# EAGLE design scheme (EAGLE 6.4)
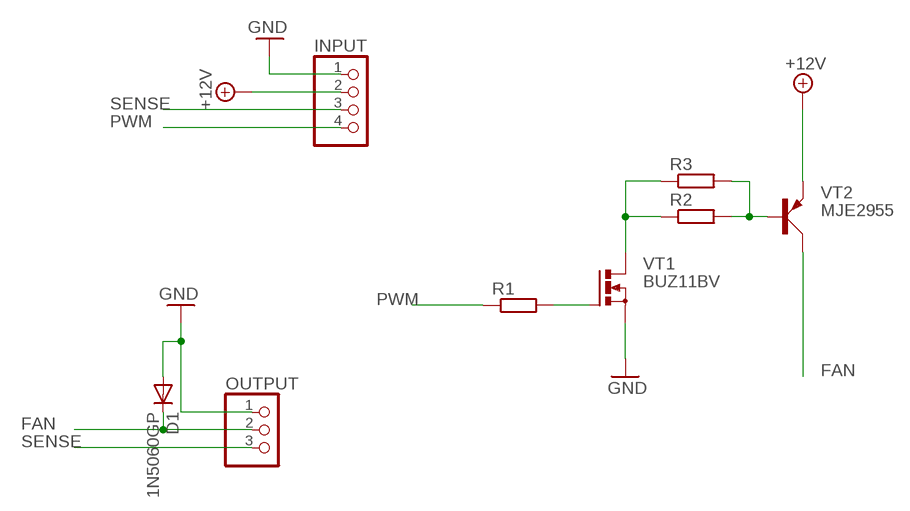
[diagram p0: schematic, sheet 1]

## Parts
D1  1N5060GP  [DO15-12]
INPUT  PINHD-1X4  [1X04]
OUTPUT  PINHD-1X3  [1X03]
R1  R-EU_0204/7  [0204/7]
R2  R-EU_0411/15  [0411/15]
R3  R-EU_0411/15  [0411/15]
VT1  BUZ11BV  [TO220BV]
VT2  MJE2955  [TO220AV]

## Nets
+12V: INPUT.2 VT2.E
FAN: D1.C OUTPUT.2 VT2.C
GND: D1.A INPUT.1 OUTPUT.1 VT1.S
N$2: R2.2 R3.2 VT2.B
N$3: R2.1 R3.1 VT1.D
N$4: R1.2 VT1.G
PWM: INPUT.4 R1.1
SENSE: INPUT.3 OUTPUT.3

## Library data of the parts
D1 = diode:1N5060GP: DIODE controlled avalanche rectifier
INPUT = pinhead:PINHD-1X4: PIN HEADER
OUTPUT = pinhead:PINHD-1X3: PIN HEADER
R1-R3 = resistor:R-EU_: RESISTOR, European symbol
VT1 = transistor-power:BUZ11: N-CHANNEL MOS FET
VT2 = transistor-power:MJE2955: PNP TRANSISTOR

## Board
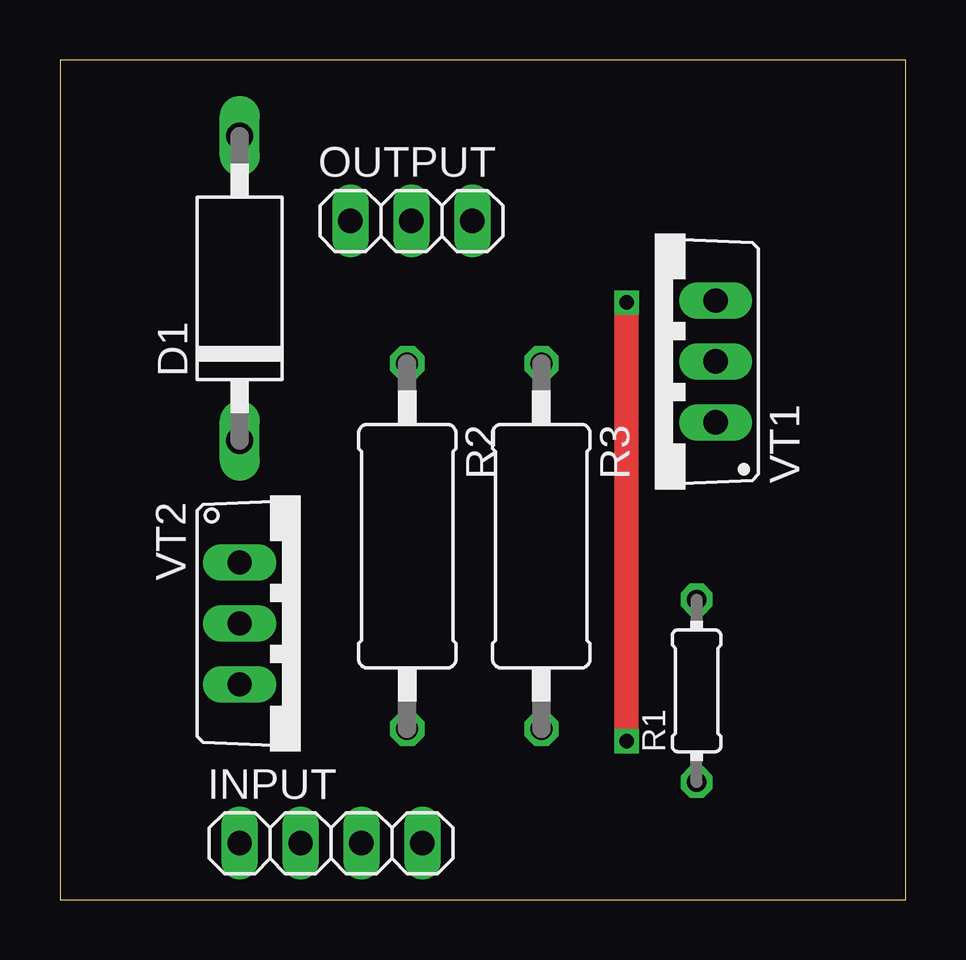
[diagram p1: board, top side]
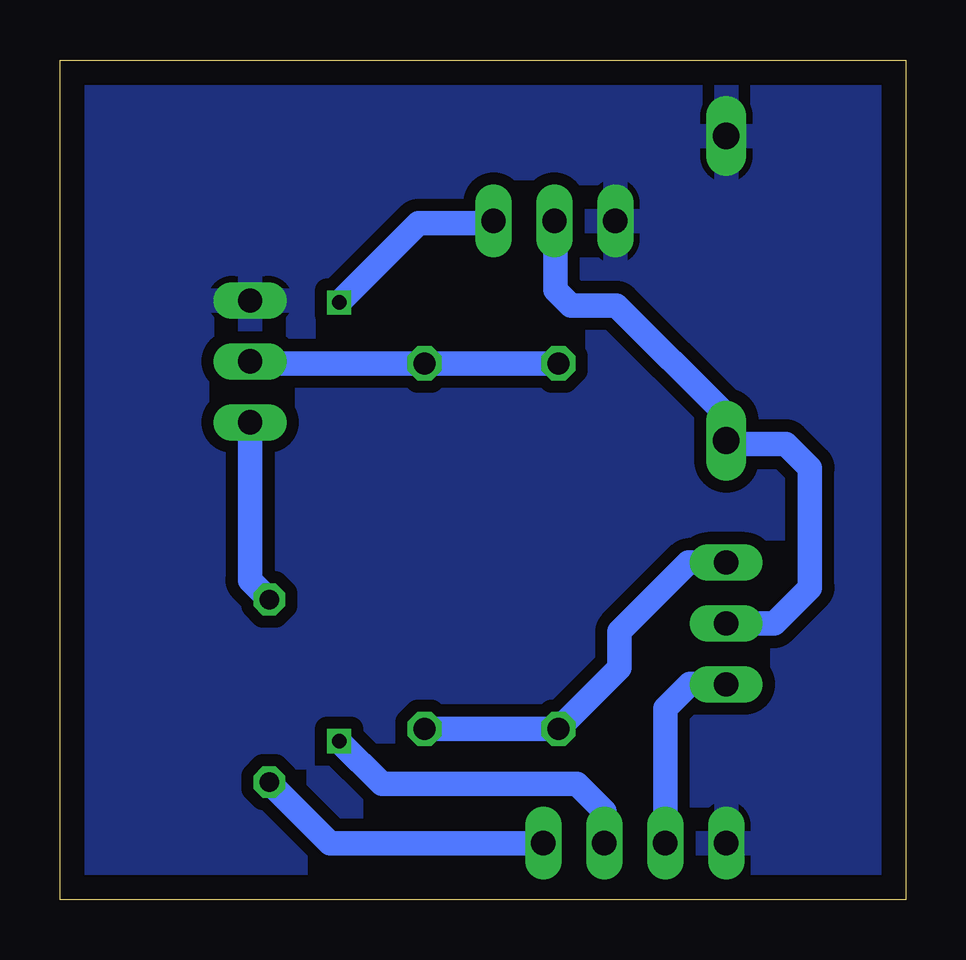
[diagram p2: board, bottom side, seen from below]

Size 35.26 x 35 mm. Coordinates in mm from the lower left corner, seen from the top.
Outline: 0,0 35.26,0 35.26,35 0,35 0,0
Copper layers (1*16): Top 0.035mm / dielectric 1.5mm / Bottom 0.035mm
Design rules "default": minimum track width 10mil, minimum drill 24mil, track to track 8mil, track to pad 8mil, pad to pad 8mil, via to via 8mil, smd to smd 8mil, copper to edge 40mil, drill to drill 8mil, minimum pad ring 10mil, minimum via ring 8mil, stop-mask expansion 4mil, vias tented up to drill 0mil, thermal gap 10mil

### Footprints (pad centres in the part's own frame; a part is rotated, then mirrored left to right if it is on the bottom)
DO15-12 = drill 1.118 long: A 6.35,0; C -6.35,0
1X04 = drill 1.016 long: 1 -3.81,0; 2 -1.27,0; 3 1.27,0; 4 3.81,0
1X03 = drill 1.016 long: 1 -2.54,0; 2 0,0; 3 2.54,0
0204/7 = drill 0.813 octagon: 1 -3.81,0; 2 3.81,0
0411/15 = drill 0.914 octagon: 1 -7.62,0; 2 7.62,0
TO220BV = drill 1.016 long: D 0,-2.54; G -2.54,-2.54; S 2.54,-2.54
TO220AV = drill 1.016 long: B -2.54,-2.54; C 0,-2.54; E 2.54,-2.54

### Placement (x,y rotation side)
D1  7.49,25.48 90 top
INPUT  11.3,2.35 0 top
OUTPUT  14.65,28.29 0 top
R1  26.54,8.7 90 top
R2  14.48,14.73 270 top
R3  20.07,14.73 270 top
VT1  24.8,22.43 90 top
VT2  10.03,11.51 270 top

### Tracks (layer width: path | path; a pad name or v marks a point on that pad's centre or on a via)
+12V
  Bottom 1.016: INPUT.2 10.03,7.97 9,9 7.52,9 VT2.E
FAN
  Bottom 1.016: VT2.C 5.49,11.51 4,13 4,18 5,19 7.36,19 D1.C 7.49,20.19 12.06,24.77 13.97,24.77 14.61,25.4 14.61,28.25 OUTPUT.2
GND
  pour Bottom (isolate 0.508): 1.27,0 1.27,36.75 40.64,36.75 40.64,0
N$2
  Bottom 1.016: VT2.B 9.06,14.05 11.94,11.18 11.94,9.65 R2.2 R3.2
N$3
  Bottom 1.016: R2.1 R3.1 27.26,22.35 VT1.D
N$4
  Bottom 1.016: VT1.G 27.34,13.31 R1.2
PWM
  Bottom 1.016: INPUT.4 24,2.35 R1.1
SENSE  (via drill 0.6)
  Top 1.016: v23.62,6.6 v23.62,24.89
  Bottom 1.016: INPUT.3 12.57,3.68 13.72,4.83 21.84,4.83 v23.62,6.6 | v23.62,24.89 20.32,28.19 17.29,28.19 OUTPUT.3